# EAGLE design Spectacle_Director_Board (EAGLE 7.7.0)
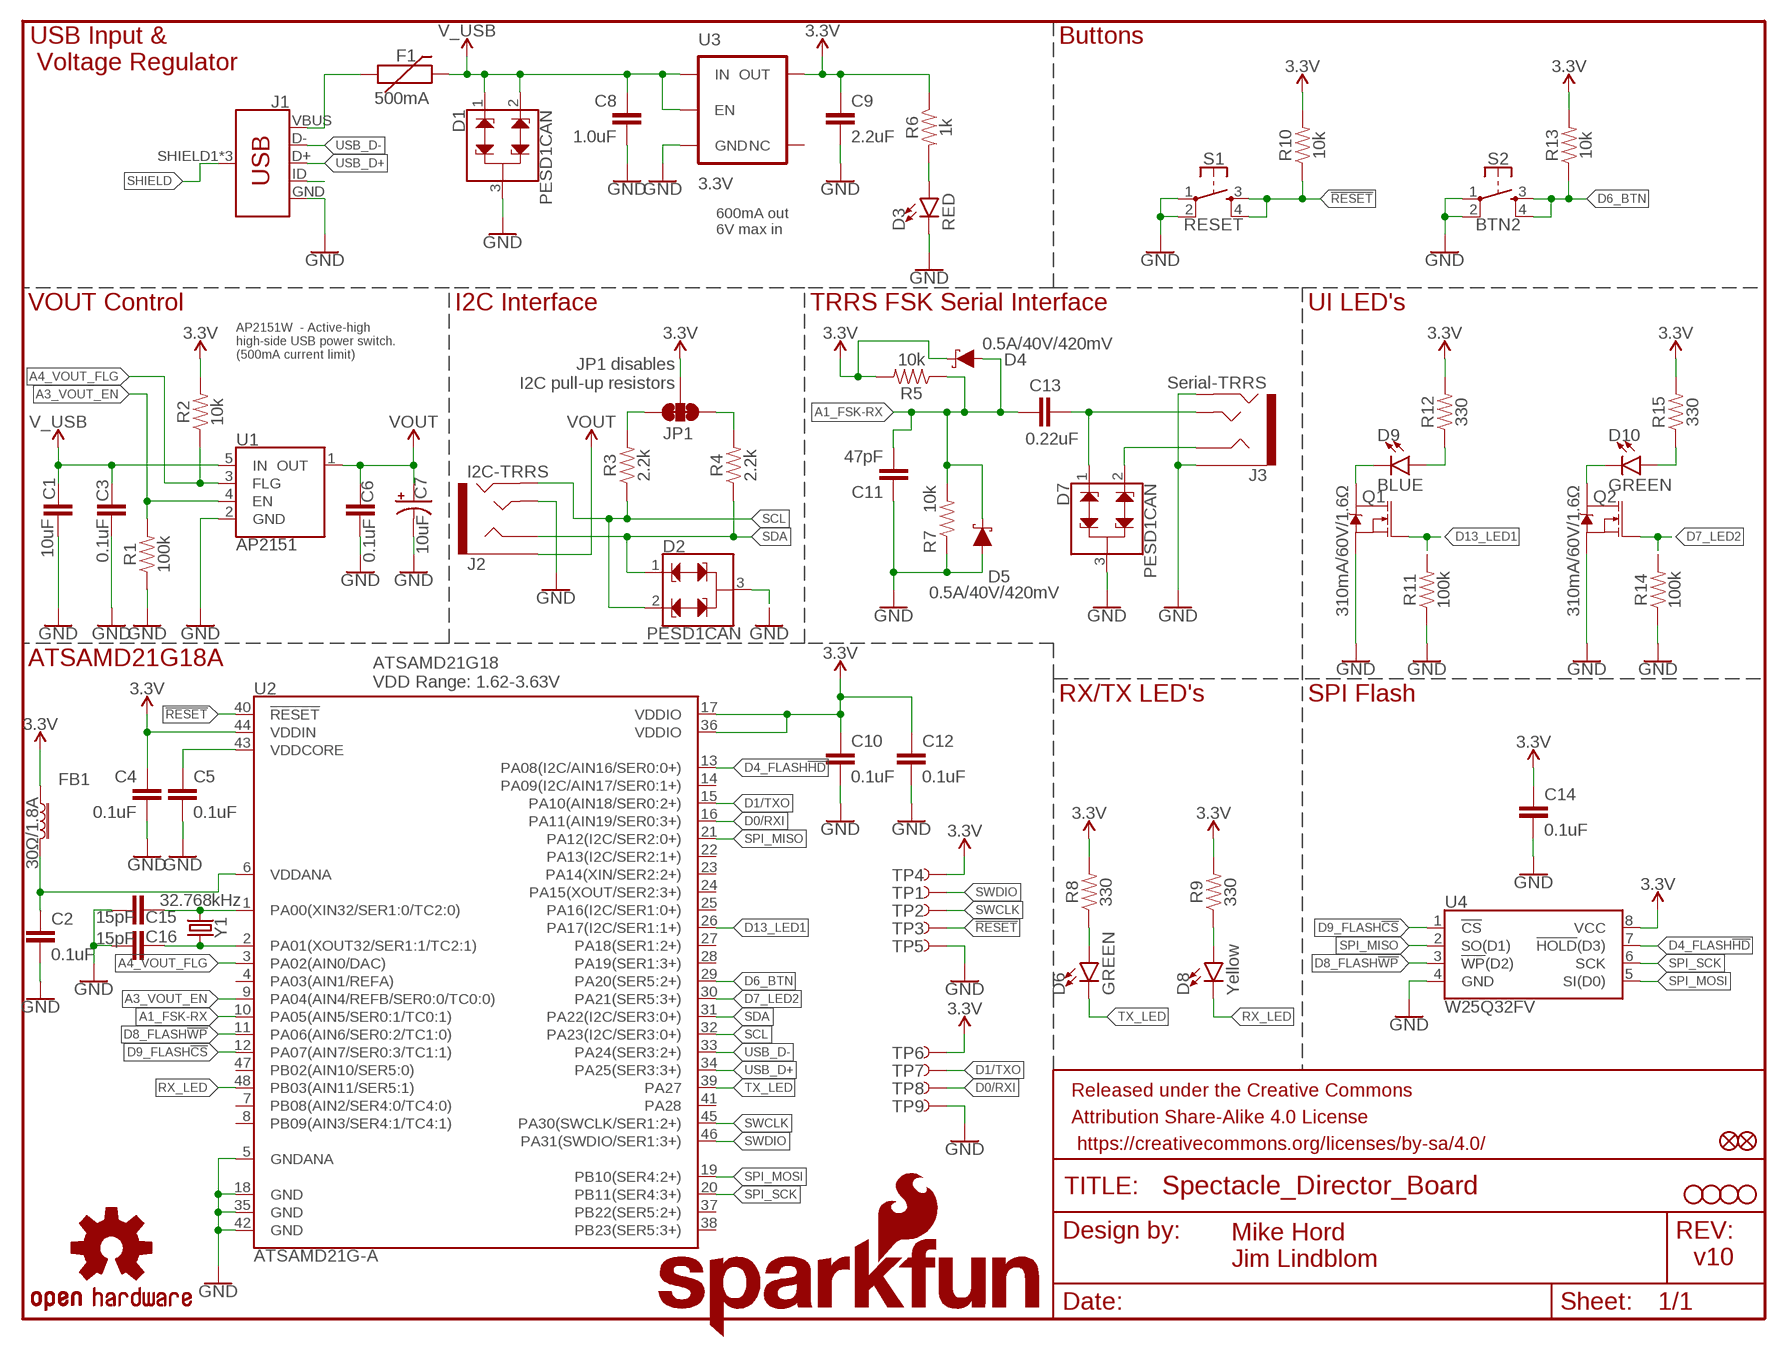
[diagram p0: schematic, sheet 1]

## Parts
C1  10uF  10UF-0805-10V-10%  [0805]
C2  0.1uF  0.1UF-0603-25V-(+80/-20%)  [0603]
C3  0.1uF  0.1UF-0603-25V-(+80/-20%)  [0603]
C4  0.1uF  0.1UF-0603-25V-(+80/-20%)  [0603]
C5  0.1uF  0.1UF-0603-25V-(+80/-20%)  [0603]
C6  0.1uF  0.1UF-0603-25V-(+80/-20%)  [0603]
C7  10uF  10UF-POLAR-EIA3216-16V-10%(TANT)  [EIA3216]
C8  1.0uF  1.0UF-0805-25V-(+80/-20%)  [0805]
C9  2.2uF  2.2UF-0603-10V-20%  [0603]
C10  0.1uF  0.1UF-0603-25V-(+80/-20%)  [0603]
C11  47pF  47PF-0603-50V-5%  [0603]
C12  0.1uF  0.1UF-0603-25V-(+80/-20%)  [0603]
C13  0.22uF  0.22UF-0603-25V-10%  [0603]
C14  0.1uF  0.1UF-0603-25V-(+80/-20%)  [0603]
C15  15pF  15PF-0603-50V-5%  [0603]
C16  15pF  15PF-0603-50V-5%  [0603]
D1  PESD1CAN  [SOT23-3]
D2  PESD1CAN  [SOT23-3]
D3  RED  LED-RED0603  [LED-0603]
D4  0.5A/40V/420mV  DIODE-SCHOTTKY-PMEG4005EJ  [SOD-323]
D5  0.5A/40V/420mV  DIODE-SCHOTTKY-PMEG4005EJ  [SOD-323]
D6  GREEN  LED-GREEN0603  [LED-0603]
D7  PESD1CAN  [SOT23-3]
D8  Yellow  LED-YELLOW0603  [LED-0603]
D9  BLUE  LED-BLUE0603  [LED-0603]
D10  GREEN  LED-GREEN0603  [LED-0603]
F1  500mA  PTCSMD  [PTC-1206]
FB1  30Ω/1.8A  FERRITE_BEAD-0603  [0603]
FD1  FIDUCIALUFIDUCIAL  [FIDUCIAL-MICRO]
FD2  FIDUCIALUFIDUCIAL  [FIDUCIAL-MICRO]
FRAME1  FRAME-LETTER  [CREATIVE_COMMONS]
H1  STAND-OFF  [STAND-OFF]
H2  STAND-OFF  [STAND-OFF]
H3  STAND-OFF  [STAND-OFF]
H4  STAND-OFF  [STAND-OFF]
J1  USB_MICRO-B_FEMALE-SMT  [USB-B-MICRO-SMD]
J2  I2C-TRRS  AUDIO_JACK_TRRSSMD_RA  [AUDIO_JACK_3.5MM_TRRS_SMD_RA]
J3  Serial-TRRS  AUDIO_JACK_TRRSSMD_RA  [AUDIO_JACK_3.5MM_TRRS_SMD_RA]
JP1  JUMPER-SMT_3_2-NC_TRACE_NO-SILK  [SMT-JUMPER_3_2-NC_TRACE_NO-SILK]
LOGO1  OSHW-LOGOMINI  [OSHW-LOGO-MINI]
LOGO2  SFE_LOGO_NAME.2_INCH  [SFE_LOGO_NAME_.2]
LOGO3  SFE_LOGO_FLAME.1COP  [SFE_LOGO_FLAME_COPPER_.1]
Q1  310mA/60V/1.6Ω  MOSFET-NCH-2N7002PW  [SOT323]
Q2  310mA/60V/1.6Ω  MOSFET-NCH-2N7002PW  [SOT323]
R1  100k  100KOHM-0603-1/10W-1%  [0603]
R2  10k  10KOHM-0603-1/10W-1%  [0603]
R3  2.2k  2.2KOHM-0603-1/10W-1%  [0603]
R4  2.2k  2.2KOHM-0603-1/10W-1%  [0603]
R5  10k  10KOHM-0603-1/10W-1%  [0603]
R6  1k  1KOHM-0603-1/10W-1%  [0603]
R7  10k  10KOHM-0603-1/10W-1%  [0603]
R8  330  330OHM-0603-1/10W-1%  [0603]
R9  330  330OHM-0603-1/10W-1%  [0603]
R10  10k  10KOHM-0603-1/10W-1%  [0603]
R11  100k  100KOHM-0603-1/10W-1%  [0603]
R12  330  330OHM-0603-1/10W-1%  [0603]
R13  10k  10KOHM-0603-1/10W-1%  [0603]
R14  100k  100KOHM-0603-1/10W-1%  [0603]
R15  330  330OHM-0603-1/10W-1%  [0603]
S1  RESET  MOMENTARY-SWITCH-SPST-2-SMD-4.6X2.8MM  [TACTILE_SWITCH_SMD_4.6X2.8MM]
S2  BTN2  MOMENTARY-SWITCH-SPST-2-SMD-4.6X2.8MM  [TACTILE_SWITCH_SMD_4.6X2.8MM]
TP1  TP-SWDIO  TEST-POINT3X5  [PAD.03X.05]
TP2  TP-SWCLK  TEST-POINT3X5  [PAD.03X.05]
TP3  TP-!RESET!  TEST-POINT3X5  [PAD.03X.05]
TP4  TP-3.3V  TEST-POINT3X5  [PAD.03X.05]
TP5  TP-GND  TEST-POINT3X5  [PAD.03X.05]
TP6  TP-GND  TEST-POINT3X5  [PAD.03X.05]
TP7  TP-GND  TEST-POINT3X5  [PAD.03X.05]
TP8  TP-GND  TEST-POINT3X5  [PAD.03X.05]
TP9  TP-GND  TEST-POINT3X5  [PAD.03X.05]
U1  AP2151  AP2151W  [SOT23-5]
U2  ATSAMD21G-A  [TQFP-48]
U3  3.3V  V_REG_AP2112K-3.3V  [SOT23-5]
U4  W25Q32FV  W25Q32FVSS  [SOIC-8]
Y1  32.768kHz  CRYSTAL-32.768KHZSMD-3.2X1.5  [CRYSTAL-SMD-3.2X1.5MM]

## Nets
3.3V: C4.1 C9.1 C10.1 C12.1 C14.1 D4.C FB1.1 JP1.2 R2.2 R5.2 R6.1 R8.2 R9.2 R10.2 R12.2 R13.2 R15.2 TP4.P$1 TP6.P$1 U2.17(VDDIO) U2.36(VDDIO) U2.44(VDDIN) U3.5(OUT) U4.8(VCC)
!RESET: R10.1 S1.3 S1.4 TP3.P$1 U2.40(!RESET!)
A1_FSK-RX: C11.2 C13.1 D4.A D5.C R5.1 R7.2 U2.10(PA05(AIN5/SER0:1/TC0:1))
A3_VOUT_EN: R1.2 U1.4(EN) U2.9(PA04(AIN4/REFB/SER0:0/TC0:0))
A4_VOUT_FLG: R2.1 U1.3(FLG) U2.3(PA02(AIN0/DAC))
D0/RXI: TP8.P$1 U2.16(PA11(AIN19/SER0:3+))
D1/TXO: TP7.P$1 U2.15(PA10(AIN18/SER0:2+))
D4_FLASH!HD!: U2.13(PA08(I2C/AIN16/SER0:0+)) U4.7(!HOLD!(D3))
D6_BTN: R13.1 S2.3 S2.4 U2.29(PA20(SER5:2+))
D7_LED2: Q2.1(G) R14.2 U2.30(PA21(SER5:3+))
D8_FLASH!WP!: U2.11(PA06(AIN6/SER0:2/TC1:0)) U4.3(!WP!(D2))
D9_FLASH!CS!: U2.12(PA07(AIN7/SER0:3/TC1:1)) U4.1(!CS!)
D13_LED1: Q1.1(G) R11.2 U2.26(PA17(I2C/SER1:1+))
GND: C1.2 C2.2 C3.2 C4.2 C5.2 C6.2 C7.- C8.2 C9.2 C10.2 C11.1 C12.2 C14.2 C15.1 C16.1 D1.3 D2.3 D3.C D5.A D7.3 J1.GND J2.TIP J3.EARTH J3.RING2 Q1.2(S) Q2.2(S) R1.1 R7.1 R11.1 R14.1 S1.1 S1.2 S2.1 S2.2 TP5.P$1 TP9.P$1 U1.2(GND) U2.5(GNDANA) U2.18(GND) U2.35(GND) U2.42(GND) U3.2(GND) U4.4(GND)
N$1: D10.A R15.1
N$2: D3.A R6.2
N$3: C15.2 U2.1(PA00(XIN32/SER1:0/TC2:0)) Y1.P$2
N$4: JP1.3 R3.2
N$5: JP1.1 R4.2
N$6: C16.2 U2.2(PA01(XOUT32/SER1:1/TC2:1)) Y1.P$1
N$7: D10.C Q2.3(D)
N$9: D9.A R12.1
N$10: D9.C Q1.3(D)
N$11: D6.A R8.1
N$12: D8.A R9.1
RING1-RIGHT: D7.2 J3.RING1
RX_LED: D8.C U2.48(PB03(AIN11/SER5:1))
SCL: D2.2 J2.RING2 R3.1 U2.32(PA23(I2C/SER3:0+))
SDA: D2.1 J2.RING1 R4.1 U2.31(PA22(I2C/SER3:0+))
SHIELD: J1.SHIELD1(SHIELD) J1.SHIELD2(SHIELD) J1.SHIELD3(SHIELD)
SPI_MISO: U2.21(PA12(I2C/SER2:0+)) U4.2(SO(D1))
SPI_MOSI: U2.19(PB10(SER4:2+)) U4.5(SI(D0))
SPI_SCK: U2.20(PB11(SER4:3+)) U4.6(SCK)
SWCLK: TP2.P$1 U2.45(PA30(SWCLK/SER1:2+))
SWDIO: TP1.P$1 U2.46(PA31(SWDIO/SER1:3+))
TIP-LEFT: C13.2 D7.1 J3.TIP
TX_LED: D6.C U2.39(PA27)
USB_D+: J1.D+ U2.34(PA25(SER3:3+))
USB_D-: J1.D- U2.33(PA24(SER3:2+))
USB_ID: J1.ID
V_USB: C1.1 C3.1 C8.1 D1.1 D1.2 F1.2 U1.5(IN) U3.1(IN) U3.3(EN)
VDDANA: C2.1 FB1.2 U2.6(VDDANA)
VDDCORE: C5.1 U2.43(VDDCORE)
VOUT: C6.1 C7.+ J2.EARTH U1.1(OUT)
VUSB: F1.1 J1.VBUS
Unconnected: U2.4(PA03(AIN1/REFA)) U2.7(PB08(AIN2/SER4:0/TC4:0)) U2.8(PB09(AIN3/SER4:1/TC4:1)) U2.14(PA09(I2C/AIN17/SER0:1+)) U2.22(PA13(I2C/SER2:1+)) U2.23(PA14(XIN/SER2:2+)) U2.24(PA15(XOUT/SER2:3+)) U2.25(PA16(I2C/SER1:0+)) U2.27(PA18(SER1:2+)) U2.28(PA19(SER1:3+)) U2.37(PB22(SER5:2+)) U2.38(PB23(SER5:3+)) U2.41(PA28) U2.47(PB02(AIN10/SER5:0)) U3.4(NC)

## Notes on the sheet
- USB Input &
   Voltage Regulator
- Buttons
- 600mA out
  6V max in
- VOUT Control | I2C Interface | TRRS FSK Serial Interface | UI LED's
- AP2151W  - Active-high 
  high-side USB power switch.
  (500mA current limit)
- JP1 disables
  I2C pull-up resistors
- ATSAMD21G18A
- RX/TX LED's | SPI Flash
- ATSAMD21G18
  VDD Range: 1.62-3.63V
- Mike Hord
  Jim Lindblom
- v10

## Library data of the parts
C1 = SparkFun-Capacitors:10UF: 10.0µF ceramic capacitors A capacitor is a passive two-terminal electrical component used to store electrical energy temporarily in an electric field.; PROD_ID: CAP-11330
C2-C6 C10 C12 C14 = SparkFun-Capacitors:0.1UF: 0.1µF ceramic capacitors A capacitor is a passive two-terminal electrical component used to store electrical energy temporarily in an electric field.; PROD_ID: CAP-00810
C7 = SparkFun-Capacitors:10UF-POLAR: 10.0µF polarized capacitors A capacitor is a passive two-terminal electrical component used to store electrical energy temporarily in an electric field.; PROD_ID: CAP-00811
C8 = SparkFun-Capacitors:1.0UF: 1µF ceramic capacitors A capacitor is a passive two-terminal electrical component used to store electrical energy temporarily in an electric field.; PROD_ID: CAP-11625
C9 = SparkFun-Capacitors:2.2UF: 2.2µF ceramic capacitors A capacitor is a passive two-terminal electrical component used to store electrical energy temporarily in an electric field.; PROD_ID: CAP-07888
C11 = SparkFun-Capacitors:47PF: 47pF ceramic capacitors A capacitor is a passive two-terminal electrical component used to store electrical energy temporarily in an electric field.; PROD_ID: CAP-08913
C13 = SparkFun-Capacitors:0.22UF: 0.22µF ceramic capacitors A capacitor is a passive two-terminal electrical component used to store electrical energy temporarily in an electric field.; PROD_ID: CAP-07822
C15 C16 = SparkFun-Capacitors:15PF: 15pF ceramic capacitors A capacitor is a passive two-terminal electrical component used to store electrical energy temporarily in an electric field.; PROD_ID: CAP-07881
D1 D2 D7 = SparkFun-DiscreteSemi:PESD1CAN: CAN bus ESD protection diode PESD1CAN is used to protect two CAN bus lines from ESD. Link to datasheet <http://www.nxp.com/documents/data_sheet/PESD1CAN-U.pdf> SparkFun Products: SparkFun CAN-BUS Shield <https://www.sparkfun.com/products/13262>; PROD_ID: DIO-12501
D3 = SparkFun-LED:LED-RED: Red SMD LED Used in manufacturing of most products at SparkFun Packages: 0603 - SMD 0603 package [Product Link] <http://docs.avagotech.com/docs/AV02-0551EN> 0603 SMART - SMD 0603 SMART package ( more efficient and expensive)[Product Link] <http://www.osram-os.com/Graphics/XPic2/00077099_0.pdf> 1206 - SMD1206 package [Product Link] <https://www.sparkfun.com/datasheets/DevTools/LilyPad/Q150OVS4.pdff> SparkFun Products: Pro Mini 328 -5V <https://www.sparkfun.com/products/821> RedBoard <https://www.sparkfun.com/products/12757> IOIO-OTG <https://www.sparkfun.com/products/13613>; PROD_ID: DIO-00819
D4 D5 = SparkFun-DiscreteSemi:DIODE-SCHOTTKY: Schottky diode A Schottky diode is a semiconductor diode which has a low forward voltage drop and a very fast switching action.; PROD_ID: DIO-10955
D6 D10 = SparkFun-LED:LED-GREEN: Green SMD LED Used in manufacturing of various products at SparkFun Packages: 0603 - SMD 0603 package [Product Link] <http://www.futureelectronics.com/en/technologies/semiconductors/optoelectronics/leds/Pages/9894312-LTST-C190GKT.aspx?CrossPart=HSMG-C190&IM=0> LilyPad 1206 - SMD1206 LilyPad package [Product Link] <http://www.futureelectronics.com/en/Technologies/Product.aspx?ProductID=IN150NGHARVATEKCORPORATION2049943&IM=0> 1206 - SMD1206 package [Product Link] <http://www.futureelectronics.com/en/technologies/semiconductors/optoelectronics/leds/Pages/8315665-LTST-C150KGKT.aspx?IM=0> 1206 Bottom Mount -SMD 1206 Bottom Mount [Product Link] <http://www.digikey.com/product-detail/en/lite-on-inc/LTST-C230KGKT/160-1456-1-ND/386854> SparkFun Products: Pro Mini 328 -5V <https://www.sparkfun.com/products/821> RedBoard <https://www.sparkfun.com/products/12757> MP3 Trigger <https://www.sparkfun.com/products/13720> Makey Makey <https://www.sparkfun.com/products/11076>; PROD_ID: DIO-00821
D8 = SparkFun-LED:LED-YELLOW: Yellow SMD LED Used in manufacturing several products at SparkFun. Packages: 0603 - SMD 0603 package[Product Link] <http://www.kingbrightusa.com/product.asp?catalog_name=LED&product_id=APT1608SYCK> 0603 -SMART - SMART SMD 0603 package (more efficient/more expensive) [Product Link] <http://www.osram-os.com/osram_os/en/products/product-catalog/led-light-emitting-diodes/smartled-0603/ly-l29k/index.jsp> LilyPad - SMD1206 package[Product Datasheet] <https://www.sparkfun.com/datasheets/DevTools/LilyPad/Q150YUS4.pdf> SparkFun Products: Blynk Board <https://www.sparkfun.com/products/13794> IOIO-OTG <https://www.sparkfun.com/products/13613> XBee Explorer Serial <https://www.sparkfun.com/products/13225>; PROD_ID: DIO-09003
D9 = SparkFun-LED:LED-BLUE: Blue SMD LED Used in manufacturing of various products at SparkFun Packages: 0603 - SMD 0603 package [Product Link] <http://www.digikey.com/product-detail/en/SMLE12BC7TT86/511-1589-2-ND/1641808> 1206 - SMD1206 package [Product Link] <http://www.digikey.com/product-detail/en/lite-on-inc/LTST-C150TBKT/160-1643-1-ND/573584> SparkFun Products: ESP8266 Thing-Dev Board <https://www.sparkfun.com/products/13711> RedBoard <https://www.sparkfun.com/products/12757>; PROD_ID: DIO-08575
F1 = SparkFun-PowerIC:PTC: Resettable Fuse PTC Resettable Fuse. Spark Fun Electronics SKU : COM-08357; PROD_ID: RES-11150
FB1 = SparkFun-Inductors:FERRITE_BEAD: Ferrite Bead (blocks, cores, rings, chokes, etc.) Inductor with layers of ferrite used to suppress high frequencies. Often used to isolate high frequency noise. SparkFun Products: IOIO-OTG - V2.2 <https://www.sparkfun.com/products/13613> SparkFun SAMD21 Mini Breakout <https://www.sparkfun.com/products/13664> SparkFun 6 Degrees of Freedom Breakout - LSM6DS3 <https://www.sparkfun.com/products/13339> SparkFun SAMD21 Dev Breakout <https://www.sparkfun.com/products/13672>; PROD_ID: NDUC-07859
FD1 FD2 = SparkFun-Aesthetics:FIDUCIAL: Fiducial Alignment Points Point-of-reference for pick-and-place machines and other optical instruments.
FRAME1 = SparkFun-Aesthetics:FRAME-LETTER: Schematic Frame - Letter Standard 8.5x11 US Letter frame
H1-H4 = SparkFun-Hardware:STAND-OFF: Stand Off Drill holes for mechanically mounting via screws, standoffs, etc. Note: Use the keepout ring to avoid running the screw head into surrounding components. Variant Overviews STAND-OFF - Mechanical footprint for a #4 phillips button head screw. STAND-OFF-TIGHT - Mechanical footprint for a #4 phillips button head screw, Example SparkFun Products Screw - Phillips Head (1/4", 4-40, 10 pack) <https://www.sparkfun.com/products/10453> (PRT-10453) Screw - Phillips Head (1/2", 4-40, 10 pack) <https://www.sparkfun.com/products/10452> (PRT-10452) Screw - Phillips Head (3/4", 4-40, 10 pack) <https://www.sparkfun.com/products/10451> (PRT-10451) Screw - Phillips Head (1", 4-40, 10 pack) <https://www.sparkfun.com/products/10450> (PRT-10450)
J1 = SparkFun-Connectors:USB_MICRO-B: USB Type Micro-B Connector Male/female and PTH/SMT variants SparkFun Products: SparkFun microB USB Breakout <https://www.sparkfun.com/products/12035> SparkFun USB microB Plug Breakout <https://www.sparkfun.com/products/10031> SparkFun ESP8266 Thing <https://www.sparkfun.com/products/13231>; PROD_ID: CONN-11752
J2 J3 = SparkFun-Connectors:AUDIO_JACK_TRRS: Audio Jack - 3.5mm TRRS (SMD) This is a 3.5mm TRRS SMD audio jack. TRRS connectors are the audio-style connectors that you see on some phones, MP3 players and development boards. TRRS stands for “tip, ring, ring, sleeve,” which reflects that this has three conductors and a ground. SparkFun Products: Audio Jack <https://www.sparkfun.com/products/12639> mbed Starter Kit <https://www.sparkfun.com/products/12968> SparkFun TRRS 3.5mm Jack Breakout <https://www.sparkfun.com/products/11570>; PROD_ID: CONN-10676; SF_ID: PRT-12639
JP1 = SparkFun-Jumpers:JUMPER-SMT_3_2-NC_TRACE: Normally closed trace jumper (2 of 2 connections) This jumper has a trace between all three pads so they are normally closed (NC). Use a razor knife to open the connection(s). For best results follow the IPC guidelines for cutting traces: Cutout at least 0.063 mm (0.005 in). Remove all loose material to clean up the cut area. Seal the cut with an approved epoxy. Reapply solder to reclose the connection(s).
LOGO1 = SparkFun-Aesthetics:OSHW-LOGO: Open-Source Hardware (OSHW) Logo This logo indicates the piece of hardware it is found on incorporates a OSHW license and/or adheres to the definition of open source hardware found here: http://freedomdefined.org/OSHW
LOGO2 = SparkFun-Aesthetics:SFE_LOGO_NAME: SparkFun Font Logo This is the SparkFun name logo. The logo on the schematic will always be the same size; the package variant is the height of the flame part of the logo (or the height the flame would be, if it were drawn). Default layer for the logo on the board is tSilk.
LOGO3 = SparkFun-Aesthetics:SFE_LOGO_FLAME: SparkFun Flame Logo This is the SparkFun flame logo. The logo on the schematic will always be the same size; the package variant is the height of the flame. Default layer for the logo on the board is tSilk.
Q1 Q2 = SparkFun-DiscreteSemi:MOSFET-NCH: N-channel MOSFETs Voltage controlled devices that allow control of high current outputs. SparkFun Products: SparkFun OpenScale <https://www.sparkfun.com/products/13261> SparkFun Digital Sandbox <https://www.sparkfun.com/products/12651> SparkFun Monster Moto Shield <https://www.sparkfun.com/products/10182> SparkFun MOSFET Power Controller <https://www.sparkfun.com/products/11214>; PROD_ID: TRANS-11151
R1 R11 R14 = SparkFun-Resistors:100KOHM: 100kΩ resistor A resistor is a passive two-terminal electrical component that implements electrical resistance as a circuit element. Resistors act to reduce current flow, and, at the same time, act to lower voltage levels within circuits. - Wikipedia; PROD_ID: RES-07828
R2 R5 R7 R10 R13 = SparkFun-Resistors:10KOHM: 10kΩ resistor A resistor is a passive two-terminal electrical component that implements electrical resistance as a circuit element. Resistors act to reduce current flow, and, at the same time, act to lower voltage levels within circuits. - Wikipedia; PROD_ID: RES-00824
R3 R4 = SparkFun-Resistors:2.2KOHM: 2.2kΩ resistor A resistor is a passive two-terminal electrical component that implements electrical resistance as a circuit element. Resistors act to reduce current flow, and, at the same time, act to lower voltage levels within circuits. - Wikipedia; PROD_ID: RES-08272
R6 = SparkFun-Resistors:1KOHM: 1kΩ resistor A resistor is a passive two-terminal electrical component that implements electrical resistance as a circuit element. Resistors act to reduce current flow, and, at the same time, act to lower voltage levels within circuits. - Wikipedia; PROD_ID: RES-07856
R8 R9 R12 R15 = SparkFun-Resistors:330OHM: 330Ω resistor A resistor is a passive two-terminal electrical component that implements electrical resistance as a circuit element. Resistors act to reduce current flow, and, at the same time, act to lower voltage levels within circuits. - Wikipedia; PROD_ID: RES-00818
S1 S2 = SparkFun-Switches:MOMENTARY-SWITCH-SPST-2: Momentary Switch (Pushbutton) - SPST - Two Circuits Normally-open (NO) SPST momentary switches (buttons, pushbuttons). Schematic symbol includes two switch circuits. Variants SMD-4.6MMX2.8MM - 4.60mm x 2.80mm Tactile Momentary Button Switch - Used on SparkFun SAMD21 Mini Breakout <https://www.sparkfun.com/products/13664> SMD-5.2MM - Mini Pushbutton Switch - SMD <https://www.sparkfun.com/products/8720> - Used on Arduino Pro Mini <https://www.sparkfun.com/products/11114>; PROD_ID: SWCH-13065
TP1-TP9 = SparkFun-Connectors:TEST-POINT: SparkFun Test Points Bare copper test points for troubleshooting or In-Circuit-Testing. These are used by our Production team for verifying production board runs using pogo-pins on test beds. SparkFun Products: SparkFun LSM9DS1 Breakout <https://www.sparkfun.com/products/13284> SparkFun PSOC <https://www.sparkfun.com/products/13714> SparkFun Load Cell Amplifier <https://www.sparkfun.com/products/13879>
U1 = spectacle-director-temp:AP2151: Diodes Inc. AP2151 - Single-Channel Current-Limited (0.5A) Power Switch The AP2151 is an integrated high-side power switch optimized for Universal Serial Bus (USB) and other hot-swap applications. The AP2151 is the active-high variant of the USB 2.0-compatible AP2141/AP2151 family. They offer current and thermal limiting and short-circuit protection as well as controlled rise time and undervoltage lockout functionality. A 7ms deglitch capability on the open-drain Flag output prevents false overcurrent reporting and does not require any external components. Datasheet <http://www.diodes.com/_files/datasheets/AP2141_51.pdf>; PROD_ID: IC-13587
U2 = SparkFun-IC-Microcontroller:ATSAMD21G: Atmel SAMD21G SMART ARM-Based Microcontroller The Atmel ® | SMART ™ SAM D21 is a series of low-power microcontrollers using the 32-bit ARM ® Cortex ® -M0+ processor, and ranging from 32- to 64-pins with up to 256KB Flash and 32KB of SRAM. The SAM D21 devices operate at a maximum frequency of 48MHz and reach 2.46 CoreMark/MHz. They are designed for simple and intuitive migration with identical peripheral modules, hex compatible code, identical linear address map and pin compatible migration paths between all devices in the product series. All devices include intelligent and flexible peripherals, Atmel Event System for inter-peripheral signaling, and support for capacitive touch button, slider and wheel user interfaces. Datasheet <https://cdn.sparkfun.com/datasheets/Dev/Arduino/Boards/Atmel-42181-SAM-D21_Datasheet.pdf> SparkFun Products SparkFun SAMD21 Mini Breakout <https://www.sparkfun.com/products/13664> (DEV-13664) SparkFun SAMD21 Dev Breakout <https://www.sparkfun.com/products/13672> (DEV-13672); PROD_ID: IC-13064
U3 = SparkFun-IC-Power:V_REG_AP2112: AP2112 - 600mA CMOS LDO Regulator w/ Enable The AP2112 is CMOS process low dropout linear regulator with enable function, the regulator delivers a guaranteed 600mA (min.) continuous load current. Features Output Voltage Accuracy: ±1.5% Output Current: 600mA (Min.) Foldback Short Current Protection: 50mA Enable Function to Turn ON/OFF VOUT Low Dropout Voltage (3.3V): 250mV (Typ.) @IOUT=600mA Excellent Load Regulation: 0.2%/A (Typ.) Excellent Line Regulation: 0.02%/V (Typ.) Low Quiescent Current: 55μA (Typ.) Low Standby Current: 0.01μA (Typ.) Low Output Noise: 50μVRMS PSRR: 100Hz -65dB, 1kHz -65dB OTSD Protection Stable with 1.0μF Flexible Cap: Ceramic, Tantalum and Aluminum Electrolytic Operation Temperature Range: -40°C to 85°C ESD: MM 400V, HBM 4000V; PROD_ID: VREG-12457
U4 = SparkFun-IC-Memory:W25Q32FV: W25Q32FV 32Mb (4MB) Serial Flash Memory The W25Q32FV support the standard Serial Peripheral Interface (SPI), Dual/Quad I/O SPI as well as 2-clocks instruction cycle Quad Peripheral Interface (QPI). 104MHz, SPI, 8-SOIC-EIAJ Datasheet <http://www.winbond.com/resource-files/w25q32fv%20revh%20091613.pdf> SparkFun Products SparkFun Blynk Board - ESP8266 <https://www.sparkfun.com/products/13794> (WRL-13794); PROD_ID: IC-13229
Y1 = SparkFun-Clocks:CRYSTAL-32.768KHZ: 32.768kHz Crystal Frequency: 32.768kHz Frequency Stability: ±20ppm Load Capacitance: 12.5pF (PTH-2X6 & SMD-3.2X1.5), 6pF (SMD-2X6); PROD_ID: XTAL-13062

## Board
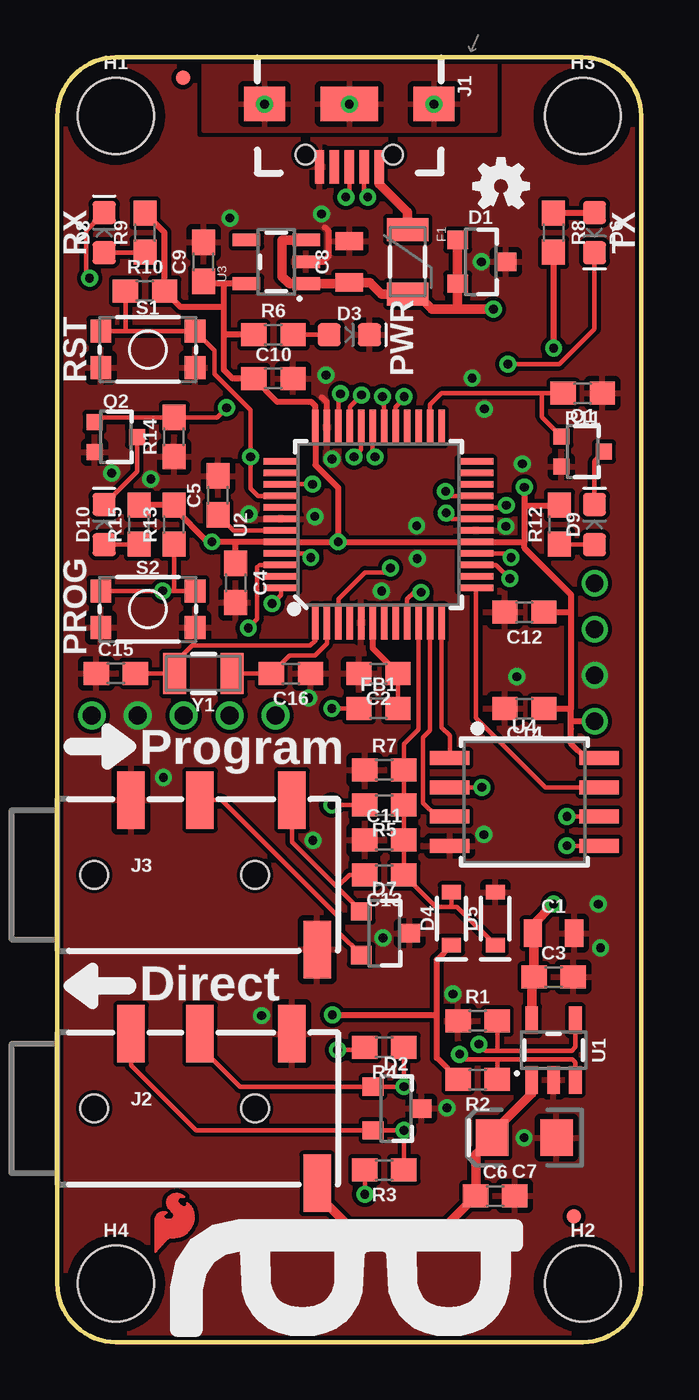
[diagram p1: board, top side]
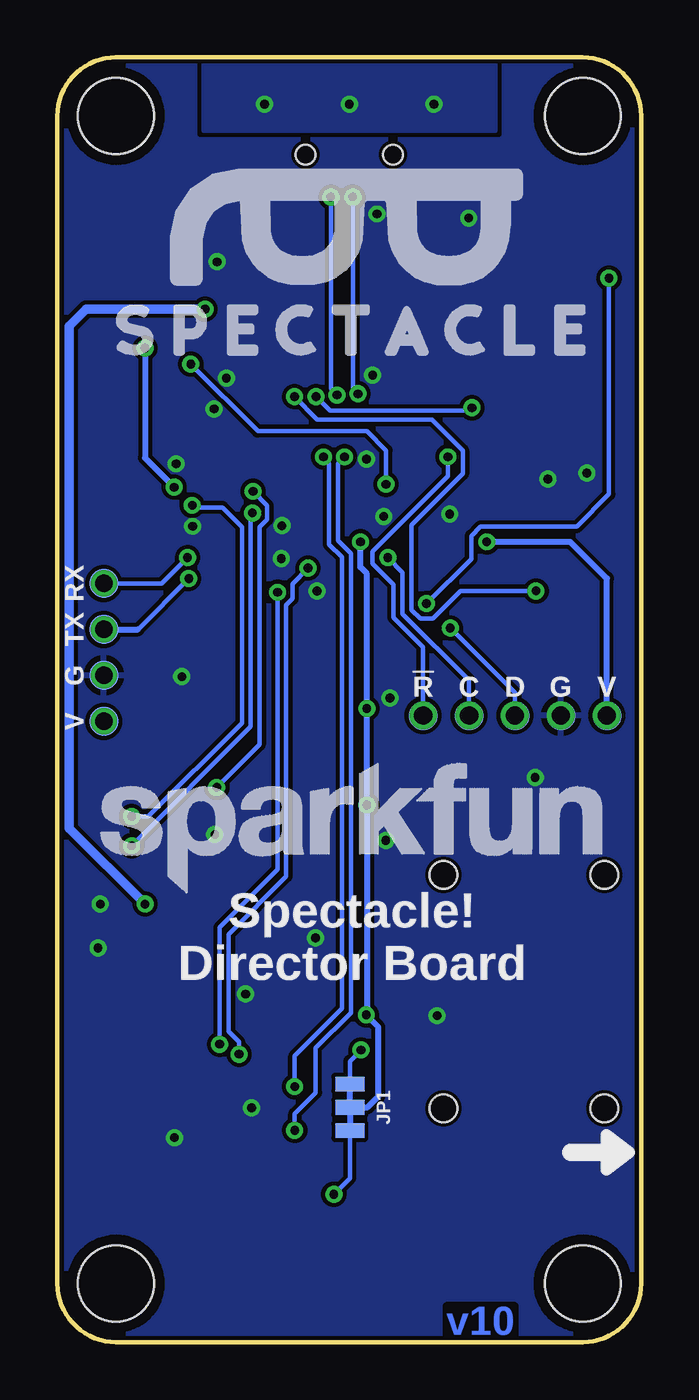
[diagram p2: board, bottom side, seen from below]

Size 25.4 x 55.88 mm. Coordinates in mm from the lower left corner, seen from the top.
Outline: 22.86,0 2.54,0 arc-90 0,2.54 0,53.34 arc-90 2.54,55.88 22.86,55.88 arc-90 25.4,53.34 25.4,2.54 arc-90 22.86,0
Copper layers (1*16): Top 0.035mm / dielectric 1.5mm / Bottom 0.035mm
Design rules "SparkFun-2-layer-TIGHT": minimum track width 7mil, minimum drill 15mil, track to track 7mil, track to pad 7mil, pad to pad 7mil, via to via 7mil, smd to smd 7mil, copper to edge 7mil, drill to drill 7mil, minimum pad ring 7mil, minimum via ring 7mil, stop-mask expansion 4mil, vias tented up to drill 25mil, thermal gap 10mil

### Footprints (pad centres in the part's own frame; a part is rotated, then mirrored left to right if it is on the bottom)
0805 = smd 0.8 x 1.2: 1 -0.9,0; 2 0.9,0
0603 = smd 1.1 x 1: 1 -0.85,0; 2 0.85,0
EIA3216 = smd 1.4 x 1.6: + 1.4,0; - -1.4,0
SOT23-3 = smd 0.8 x 0.9: 1 -0.95,-1; 2 0.95,-1; 3 0,1.1
LED-0603 = smd 1 x 1: A -0.877,0; C 0.877,0
SOD-323 = smd 0.63 x 0.83: A 1.15,0; C -1.15,0
PTC-1206 = smd 1 x 1.8: 1 -1.4,0; 2 1.4,0
FIDUCIAL-MICRO = smd 0.635 x 0.635: 1 0,0
STAND-OFF = hole 3.302: 0,0
USB-B-MICRO-SMD = smd 1.45 x 0.4: D+ 2.725,0; D- 2.725,0.65; GND 2.725,-1.3; ID 2.725,-0.65; VBUS 2.725,1.3 | smd 1.5 x 1.8: SHIELD1 0,3.685; SHIELD2 0,-3.685 | smd 1.5 x 2.5: SHIELD3 0,0 | hole 0.85: 2.2,1.9; 2.2,-1.9
AUDIO_JACK_3.5MM_TRRS_SMD_RA = smd 1.2 x 2.5: EARTH 11.3,-3.25; RING1 6.2,3.25; RING2 3.2,3.25; TIP 10.2,3.25 | hole 1.2: 1.6,0; 8.6,0
SMT-JUMPER_3_2-NC_TRACE_NO-SILK = smd 0.635 x 1.27: 1 -1.016,0; 2 0,0; 3 1.016,0
SOT323 = smd 0.7 x 0.7: 1 -0.65,-0.925; 2 0.65,-0.925; 3 0,0.925
TACTILE_SWITCH_SMD_4.6X2.8MM = smd 0.9 x 1: 1 -2.05,-0.8; 2 2.05,-0.8; 3 2.05,0.8; 4 -2.05,0.8
PAD.03X.05 = smd 1.27 x 1.27: P$1 0,0
SOT23-5 = smd 0.55 x 1.2: 1 -0.95,-1.3; 2 0,-1.3; 3 0.95,-1.3; 4 0.95,1.3; 5 -0.95,1.3
TQFP-48 = smd 1.5 x 0.28: 1 -4.25,2.75; 2 -4.25,2.25; 3 -4.25,1.75; 4 -4.25,1.25; 5 -4.25,0.75; 6 -4.25,0.25; 7 -4.25,-0.25; 8 -4.25,-0.75; 9 -4.25,-1.25; 10 -4.25,-1.75; 11 -4.25,-2.25; 12 -4.25,-2.75; 25 4.25,-2.75; 26 4.25,-2.25; 27 4.25,-1.75; 28 4.25,-1.25; 29 4.25,-0.75; 30 4.25,-0.25; 31 4.25,0.25; 32 4.25,0.75; 33 4.25,1.25; 34 4.25,1.75; 35 4.25,2.25; 36 4.25,2.75 | smd 0.28 x 1.5: 13 -2.75,-4.25; 14 -2.25,-4.25; 15 -1.75,-4.25; 16 -1.25,-4.25; 17 -0.75,-4.25; 18 -0.25,-4.25; 19 0.25,-4.25; 20 0.75,-4.25; 21 1.25,-4.25; 22 1.75,-4.25; 23 2.25,-4.25; 24 2.75,-4.25; 37 2.75,4.25; 38 2.25,4.25; 39 1.75,4.25; 40 1.25,4.25; 41 0.75,4.25; 42 0.25,4.25; 43 -0.25,4.25; 44 -0.75,4.25; 45 -1.25,4.25; 46 -1.75,4.25; 47 -2.25,4.25; 48 -2.75,4.25
SOIC-8 = smd 0.61 x 1.702: 1 -1.905,-3.251; 2 -0.635,-3.251; 3 0.635,-3.251; 4 1.905,-3.251; 5 1.905,3.251; 6 0.635,3.251; 7 -0.635,3.251; 8 -1.905,3.251
CRYSTAL-SMD-3.2X1.5MM = smd 1 x 1.8: P$1 -1.25,0; P$2 1.25,0

### Placement (x,y rotation side)
C1  21.59,17.78 0 top
C2  13.97,29.08 180 top
C3  21.59,15.88 0 top
C4  7.75,33.02 270 top
C5  6.99,36.83 90 top
C6  19.05,6.35 0 top
C7  20.32,8.89 180 top
C8  12.7,46.99 90 top
C9  6.35,46.99 90 top
C10  9.4,41.91 0 top
C11  14.22,21.84 0 top
C12  20.32,31.75 180 top
C13  14.22,20.32 180 top
C14  20.32,27.56 180 top
C15  2.54,29.08 0 top
C16  10.16,29.08 180 top
D1  18.41,46.99 270 top
D2  14.73,10.16 270 top
D3  12.7,43.81 0 top
D4  17.14,18.41 90 top
D5  19.05,18.41 90 top
D6  23.37,48.26 270 top
D7  14.22,17.78 270 top
D8  2.03,48.26 90 top
D9  23.37,35.56 90 top
D10  2.03,35.56 90 top
F1  15.24,46.99 270 top
FB1  13.97,27.56 0 top
FD1  5.46,54.99 0 top
FD2  22.48,5.46 0 top
FRAME1  -16.51,-19.05 0 top  (outside the outline)
H1  2.54,53.34 0 top
H2  22.86,2.54 0 top
H3  22.86,53.34 0 top
H4  2.54,2.54 0 top
J1  12.7,53.85 270 top
J2  0,10.16 0 top
J3  0,20.32 0 top
JP1  12.67,10.21 270 bottom
LOGO1  19.3,50.29 0 top
LOGO2  23.5,19.56 0 bottom
LOGO3  3.94,3.56 0 top
Q1  22.86,38.73 270 top
Q2  2.54,39.37 270 top
R1  18.29,13.97 0 top
R2  18.29,11.43 180 top
R3  14.22,7.49 180 top
R4  14.22,12.83 180 top
R5  14.22,23.37 180 top
R6  9.4,43.81 0 top
R7  14.22,24.89 0 top
R8  21.59,48.26 270 top
R9  3.81,48.26 90 top
R10  3.81,45.72 0 top
R11  22.86,41.27 180 top
R12  21.84,35.56 90 top
R13  5.08,35.56 90 top
R14  5.08,39.37 90 top
R15  3.56,35.56 90 top
S1  3.94,43.18 0 top
S2  3.94,31.88 0 top
TP1  5.49,27.25 0 bottom
TP2  7.49,27.25 0 bottom
TP3  9.49,27.25 0 bottom
TP4  1.49,27.25 0 bottom
TP5  3.49,27.25 0 bottom
TP6  23.38,27 0 bottom
TP7  23.38,31 0 bottom
TP8  23.38,33 0 bottom
TP9  23.38,29 0 bottom
U1  21.59,12.7 0 top
U2  13.97,35.56 90 top
U3  9.53,46.99 90 top
U4  20.32,23.5 270 top
U$1  [ORDERING_INSTRUCTIONS]  -16.51,-24.13 0 top  (outside the outline)
Y1  6.35,29.08 180 top

### Tracks (layer width: path | path; a pad name or v marks a point on that pad's centre or on a via)
3.3V  (via drill 0.38, 0.76, 0.8)
  Top 0.203: v11.94,27.56 FB1.1 | R5.2 v11.94,23.37 | 22.35,27 22.35,26.67
  Top 0.254: U3.5 7.24,46.04 | 7.24,46.04 6.45,46.04 C9.1 | 7.24,46.04 7.24,45.03 | 7.24,45.03 7.24,43.81 | 7.24,43.81 7.24,42.29 7.62,41.91 C10.1 9.56,40.89 11.05,40.89 11.22,40.72 U2.36 11.22,38.16 12.22,37.16 v12.22,34.81 | v12.22,34.81 U2.44 7.75,34.81 | v12.22,34.81 U2.17 20.32,34.81 | C4.1 7.75,34.81 | 7.75,34.81 v6.72,34.81 6.54,34.81 5.08,36.27 R13.2 | R13.2 5.12,36.41 | R13.2 R15.2 | R9.2 4.66,48.26 R10.2 5.35,45.03 7.24,45.03 | R6.1 7.24,43.81 | R8.2 v21.59,43.23 | v20.32,37.19 20.32,36.37 | 20.32,36.37 20.32,34.81 | R12.2 21.84,36.37 20.32,36.37 | 22.35,27.56 22.35,26.67 22.35,26.04 22.99,25.4 U4.8 | 20.32,34.81 20.32,34.54 22.35,32.51 22.35,31.75 | 22.35,31.75 22.35,27.56 | C12.1 22.35,31.75 | C14.1 22.35,27.56 | 16.51,14.24 16.51,16.63 D4.C | v11.96,14.24 16.51,14.24 | R2.2 16.51,12.36 16.51,14.24 | TP6.P$1 22.35,27
  Bottom 0.203: JP1.2 12.62,10.16
  Bottom 0.254: v21.59,43.23 21.59,38.46 v20.32,37.19 | JP1.2 11.9,10.21 11.43,10.68 11.43,13.7 v11.96,14.24 11.94,14.26 v11.94,23.37 v11.94,27.56 11.94,33.43 12.22,33.71 v12.22,34.81 | v6.72,34.81 3.08,34.81 1.49,33.22 TP4.P$1
  other vias: 1.49,27.25 23.38,27
!RESET  (via drill 0.38, 0.8)
  Top 0.203: S1.4 2.96,43.98 | 2.96,43.98 S1.3 6.83,43.13 6.83,42.11 8.41,40.54 v8.41,38.51 8.41,37.13 8.73,36.81 U2.40 | R10.1 2.96,43.98
  Bottom 0.203: v8.41,38.51 8.41,37.67 11.68,34.39 11.68,33.86 10.77,32.94 10.77,31.52 9.49,30.24 TP3.P$1
  other vias: 9.49,27.25
A1_FSK-RX
  Top 0.203: U2.10 15.72,26.66 15.07,26.01 R7.2 R5.1 C11.2 C13.1 16.47,18.92 17.14,18.92 | D5.C 17.39,18.92 17.14,18.92 | D4.A 17.14,18.92
A3_VOUT_EN  (via drill 0.38)
  Top 0.203: U2.9 15.22,32.31 15.52,32.61 v15.82,32.61 | U1.4 22.54,12.84 22.38,12.68 19.14,12.68 | 19.14,12.68 18.62,12.68 v18.34,12.95 | R1.2 19.14,12.68
  Bottom 0.203: v15.82,32.61 15.82,20.55 18.34,18.03 v18.34,12.95
A4_VOUT_FLG  (via drill 0.38)
  Top 0.203: U1.3 22.54,12.16 22.4,12.29 19.14,12.29 | 19.14,12.29 17.73,12.29 v17.5,12.52 | R2.1 19.14,12.29 | U2.3 12.22,32.31 13.39,33.48 14.3,33.48 v14.49,33.67
  Bottom 0.203: v14.49,33.67 15.18,32.98 15.18,32.33 15.44,32.07 15.44,20.26 17.96,17.74 17.96,13.51 17.5,13.06 v17.5,12.52
D0/RXI  (via drill 0.38, 0.76)
  Top 0.203: U2.16 19.56,34.31 v19.74,34.12
  Bottom 0.203: v19.74,34.12 20.87,33 TP8.P$1
  other vias: 23.38,33
D1/TXO  (via drill 0.38, 0.76)
  Top 0.203: U2.15 19.09,33.81 v19.68,33.21
  Bottom 0.203: v19.68,33.21 21.89,31
  Bottom 0.254: TP7.P$1 21.89,31
  other vias: 23.38,31
D4_FLASH!HD!
  Top 0.203: U2.13 18.22,27.14 21.23,24.13 U4.7
D6_BTN  (via drill 0.38)
  Top 0.203: 5.08,32.68 S2.3 5.99,32.37 | S2.4 v4.57,32.68 5.08,32.68 | U2.29 14.72,40.68 15.09,41.05 v15.09,41.12 | R13.1 5.08,32.68
  Bottom 0.203: v15.09,41.12 14.1,40.13 9.11,40.13 7.76,38.79 7.76,37.77 9.99,35.53 9.99,31.85 9.61,31.47 9.07,31.47 7.86,32.68 v4.57,32.68
D7_LED2  (via drill 0.38)
  Top 0.203: U2.30 14.22,41.05 v14.15,41.12 | 5,40.3 R14.2 | Q2.1 1.81,40.22 R14.2 | R14.2 6.95,40.22 v7.37,40.64
  Bottom 0.203: v14.15,41.12 13.54,40.51 7.49,40.51 v7.37,40.64
D8_FLASH!WP!
  Top 0.203: U2.11 16.22,26.61 15.91,26.3 15.91,23.46 16.51,22.86 U4.3
D9_FLASH!CS!
  Top 0.203: U2.12 16.72,26.74 17.07,26.39 U4.1
D13_LED1
  Top 0.203: U2.26 16.22,40.78 16.71,41.27 21.08,41.27 | Q1.1 21.08,40.24 21.08,41.27 | R11.2 21.08,41.27
GND  (via drill 0.38, 0.76, 0.8)
  Top 0.254: U2.35 11.72,40.88 11.51,41.1 | U3.2 11.56,46.99 11.81,47.24 11.81,48.31 11.63,48.49
  other vias: 3.49,27.25 11.2,35.92 11.68,42.06 19.52,35.48 11.49,49.07 7.51,48.9 18.45,46.99 15.63,35.51 14.11,32.66 19.99,28.94 18.55,22.07 8.88,14.2 11.95,38.4 8.33,36.02 20.23,38.2 4.61,24.56 17.21,15.14 20.31,8.89 23.63,17.14 23.53,19.05 16.95,10.19 15.66,34.09 11.11,21.82 2.36,37.8 4.06,37.54 23.38,29 10.93,28.02 18.58,40.59 18.05,41.94 14.17,17.58
  pour Top (isolate 0.178, rank 6): 0,55.88 0,0 25.4,0 25.4,55.88
  pour Bottom (isolate 0.178, rank 6): 25.4,55.88 25.4,0 0,0 0,55.88
N$1
  Top 0.203: R15.1 3.56,34.68 D10.A
N$2
  Top 0.203: D3.A R6.2
N$3
  Top 0.203: 5.1,29.64 5.1,29.54 | C15.2 Y1.P$2 5.1,29.54 | 5.1,29.54 5.86,30.29 10.99,30.29 11.22,30.52 U2.1
N$4  (via drill 0.38)
  Top 0.203: R3.2 v13.37,6.43
  Bottom 0.203: v13.37,6.43 12.68,7.13 JP1.3
N$5  (via drill 0.38)
  Top 0.203: R4.2 13.37,12.7 v12.19,12.7
  Bottom 0.203: JP1.1 12.68,12.22 v12.19,12.7
N$6
  Top 0.203: Y1.P$1 C16.2 10.1,29.87 11.2,29.87 11.72,30.39 U2.2
N$7
  Top 0.203: D10.C 3.46,37.87 Q2.3
N$9
  Top 0.203: R12.1 21.84,34.68 D9.A
N$10
  Top 0.203: D9.C 23.37,38.32 Q1.3
N$11
  Top 0.254: D6.A 23.34,49.11 R8.1
N$12
  Top 0.203: R9.1 3.78,47.38 D8.A
RING1-RIGHT
  Top 0.203: D7.2 12.26,17.8 12.26,18.47 7.15,23.57 J3.RING1
RX_LED  (via drill 0.38)
  Top 0.203: U2.48 9.72,32.5 v9.34,32.12 | v1.4,46.28 1.25,46.42 1.25,48.36 D8.C
  Bottom 0.203: v9.34,32.12 7.39,34.07 7.39,35.06 6.99,35.47 2.81,35.47 1.4,36.88 v1.4,46.28
SCL  (via drill 0.38)
  Top 0.203: U2.32 13.22,38.82 v12.9,38.51 | J2.RING2 3.2,12.04 6.03,9.21 D2.2 v15.07,9.21 R3.1
  Bottom 0.203: v12.9,38.51 13.2,38.21 13.2,34.86 12.64,34.3 12.64,14.31 14.16,12.79 14.16,10.85 15.07,9.93 v15.07,9.21
SDA  (via drill 0.38)
  Top 0.203: U2.31 13.72,38.6 v13.82,38.51 | R4.1 v15.07,11.11 D2.1 7.94,11.11 6.2,12.85 J2.RING1
  Bottom 0.203: v13.82,38.51 13.82,38.46 13.58,38.21 13.58,34.7 13.02,34.14 13.02,14.5 15.07,12.45 v15.07,11.11
SHIELD  (via drill 0.38)
  other vias: 9.02,53.85 16.38,53.85 12.7,53.85
  pour Bottom: 6.35,55.88 6.35,52.7 19.05,52.7 19.05,55.88
  pour Top: 6.35,55.88 6.35,52.7 19.05,52.7 19.05,55.88
SPI_MISO  (via drill 0.38)
  Top 0.203: U2.21 17.09,36.81 v16.89,37.01 | U4.2 v18.47,24.13
  Bottom 0.203: v16.89,37.01 16.27,36.39 16.27,35.79 16.61,35.45 16.61,25.98 v18.47,24.13
SPI_MOSI  (via drill 0.38)
  Top 0.203: U2.19 17.17,35.81 v16.92,36.07 | U4.5 v22.17,21.59
  Bottom 0.203: v22.17,21.59 16.99,26.77 16.99,35.99 v16.92,36.07
SPI_SCK  (via drill 0.38)
  Top 0.203: U2.20 19.44,36.31 v19.53,36.4 | U4.6 v22.17,22.86
  Bottom 0.203: v22.17,22.86 21.45,22.86 17.37,26.94 17.37,35.45 18.22,36.29 U2.20 19.44,36.31 v19.53,36.4
SWCLK  (via drill 0.38, 0.8)
  Top 0.203: U2.45 10.84,34.31 v11.02,34.12
  Bottom 0.203: v11.02,34.12 10.38,33.48 10.38,31.67 7.49,28.79 TP2.P$1
  other vias: 7.49,27.25
SWDIO  (via drill 0.38, 0.8)
  Top 0.203: U2.46 8.79,33.81 8.69,33.71 8.69,31.45 v8.31,31.06
  Bottom 0.203: v8.31,31.06 5.49,28.25 TP1.P$1
  other vias: 5.49,27.25
TIP-LEFT
  Top 0.203: D7.1 12.17,19.79 | 12.17,19.79 10.2,21.75 J3.TIP | C13.2 12.7,20.32 12.17,19.79
TX_LED  (via drill 0.38)
  Top 0.203: U2.39 v11.1,37.31 | D6.C 23.37,44.07 21.84,42.55 v19.6,42.55
  Bottom 0.203: v11.1,37.31 11.1,38.79 11.94,39.62 16.68,39.62 v19.6,42.55
USB_D+  (via drill 0.38)
  Top 0.203: v12.55,49.81 12.7,49.96 J1.D+ | U2.34 12.22,41.15 v12.32,41.25
  Bottom 0.203: v12.55,49.81 12.55,41.48 v12.32,41.25
USB_D-  (via drill 0.38)
  Top 0.203: v13.5,49.81 13.35,49.96 J1.D- | U2.33 12.72,40.69 v13.23,41.2
  Bottom 0.203: v13.5,49.81 13.5,41.47 v13.23,41.2
V_USB  (via drill 0.38)
  Top 0.406: U3.3 9.78,47.94 9.78,46.35 10.09,46.04 U3.1 12.65,46.04 C8.1 13.6,46.09 14.1,45.59 F1.2 15.65,45.59 16.31,44.93 17.41,44.93 | 17.41,44.93 v18.97,44.93 | v21.59,19.05 20.69,18.15 C1.1 20.74,17.73 C3.1 20.64,15.78 U1.5 | D1.1 D1.2 17.41,44.93
  Bottom 0.406: v18.97,44.93 24.16,44.93 24.89,44.2 24.89,22.35 v21.59,19.05
VDDANA
  Top 0.203: FB1.2 C2.1
  Top 0.254: U2.6 13.72,30.18 C2.1
VDDCORE
  Top 0.203: U2.43 7.66,35.31 C5.1
VOUT
  Top 0.406: 18.92,9.01 C7.+ | C7.+ 18.2,8.17 C6.1 16.93,5.08 12.65,5.08 11.3,6.43 J2.EARTH | U1.1 20.64,10.81 18.92,9.09 C7.+
VUSB
  Top 0.406: F1.1 15.24,49.15 14,50.39 J1.VBUS

### Text on the board
Bottom: v10
tPlace: RX | TX | PWR | RST | PROG | Program | Direct
bPlace: RX | TX | G | V | G | D | C | !R! | V | Spectacle\! / Director Board
tDocu: Mike Hord / Jim Lindblom | Silkscreen to be WHITE / Soldermask to be BLACK